# Altium schematic sheet 7-Level Converter.SchDoc
size 594 x 420 mm; SheetNumber: 7; SheetTotal: 7; PageSetup: Record=PageOptions|CenterHorizontal=False|CenterVertical=False|PrintScale=0.43|XCorrection=0.00|YCorrection=0.00|PrintKind=1|BorderSize=5000000|LeftOffset=0|BottomOffset=0|Orientation=2|PaperLength=5940|PaperWidth=4200|Scale=100|PaperSource=7|PrintQuality=-4|MediaType=1|DitherType=10|PaperKind=Personal. 1: 215,9 x 279,4 mm|PrintScaleMode=0; NumTotalFolhas: 7; NumFolha: 7
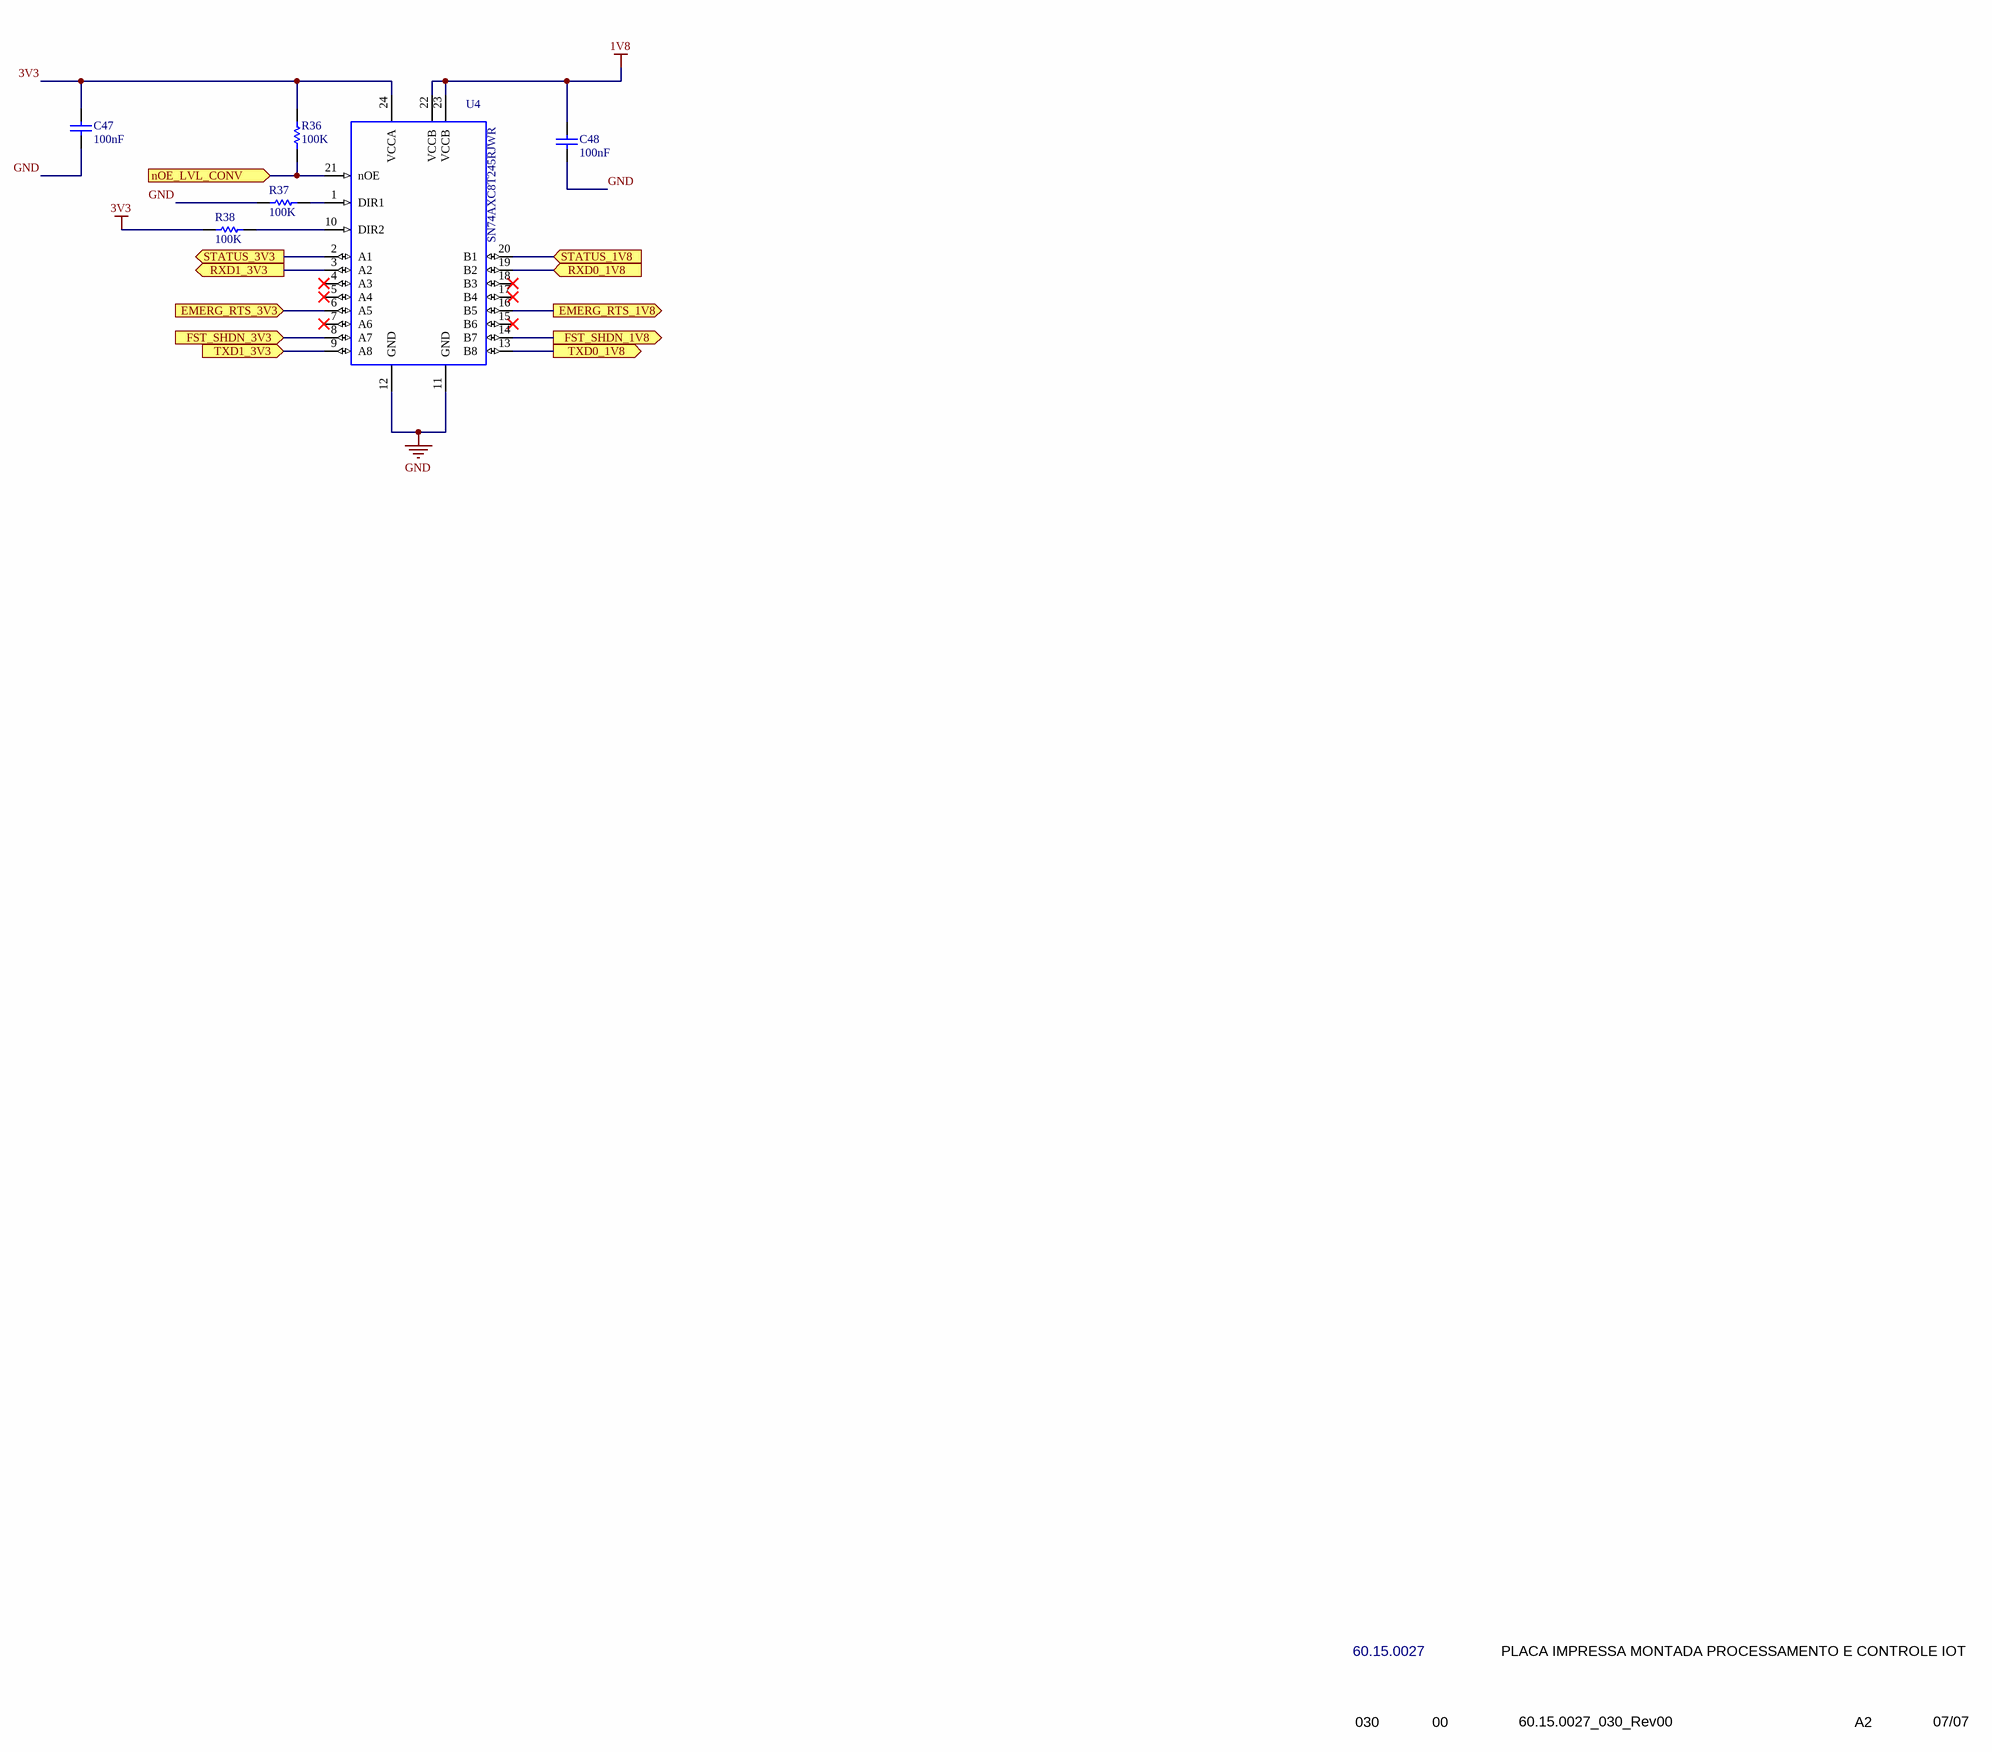
[diagram p0: 7-Level Converter.SchDoc]

## Parts
C47  16.23.0803  [16.23.0803]  (value not drawn)
C48  16.23.0803  [16.23.0803]  (value not drawn)
R36  value 100K  [66.24.1346]  (hidden comment: 66.24.1346)
R37  value 100K  [66.24.1346]  (hidden comment: 66.24.1346)
R38  value 100K  [66.24.1346]  (hidden comment: 66.24.1346)
U4  value SN74AXC8T245RJWR  [24.15.0640]  (hidden comment: 24.15.0640)

## Ports
EMERG_RTS_1V8 (out), EMERG_RTS_3V3 (in), FST_SHDN_1V8 (out), FST_SHDN_3V3 (in), nOE_LVL_CONV (in), RXD0_1V8 (in), RXD1_3V3 (out), STATUS_1V8 (in), STATUS_3V3 (out), TXD0_1V8 (out), TXD1_3V3 (in)

## Nets
1V8: C48.2 U4.22(VCCB) U4.23(VCCB)
3V3: C47.2 R36.1 R38.2 U4.24(VCCA)
GND: C47.1 C48.1 R37.2 U4.11(GND) U4.12(GND)
EMERG_RTS_1V8: U4.16(B5) ; port EMERG_RTS_1V8
EMERG_RTS_3V3: U4.6(A5) ; port EMERG_RTS_3V3
FST_SHDN_1V8: U4.14(B7) ; port FST_SHDN_1V8
FST_SHDN_3V3: U4.8(A7) ; port FST_SHDN_3V3
nOE_LVL_CONV: R36.2 U4.21(nOE) ; port nOE_LVL_CONV
RXD0_1V8: U4.19(B2) ; port RXD0_1V8
RXD1_3V3: U4.3(A2) ; port RXD1_3V3
STATUS_1V8: U4.20(B1) ; port STATUS_1V8
STATUS_3V3: U4.2(A1) ; port STATUS_3V3
TXD0_1V8: U4.13(B8) ; port TXD0_1V8
TXD1_3V3: U4.9(A8) ; port TXD1_3V3
NetR37_1: R37.1 U4.1(DIR1)
NetR38_1: R38.1 U4.10(DIR2)

Not connected (* = marked no-connect by the designer): U4 4(A3)* 5(A4)* 7(A6)* 15(B6)* 17(B4)* 18(B3)*

## Notes on the sheet
- 60.15.0027
- PLACA IMPRESSA MONTADA PROCESSAMENTO E CONTROLE IOT
- 030
- 00
- 60.15.0027_030_Rev00
- A2
- 07/07
- 1
- 2
- 3
- 4
- 5
- 6
- 7
- 8
- A
- B
- C
- D
- E
- F
- G
- H
- DOCUMENTO DE ENGENHARIA DE PRODUTO
- DOCUMENT OF PRODUCT ENGINEERING
- CÓDIGO / CODE
- DESCRIÇÃO / DESCRIPTION
- DOC
- REV
- ARQUIVO / FILE
- FORM./SIZE
- FOLHA / PAGE
- (in symbol 16.23.0803) 100nF

## Library data of the parts
C47 C48 = 16.23.0803: CAPACITOR CERAMICO 100nF 16V 10%% X5R SMD 0201
R36-R38 = 66.24.1346: RESISTOR THICK FILM 50mW 100K OHMS 1% SMD 0201
U4 = 24.15.0640: CID CONVERSOR NIVEL ALIMENTACAO DUPLA DIRECAO CONTROLADA 8 BITS 0.65V - 3.6V